# Altium schematic sheet [1]Esp32.SchDoc
size A4
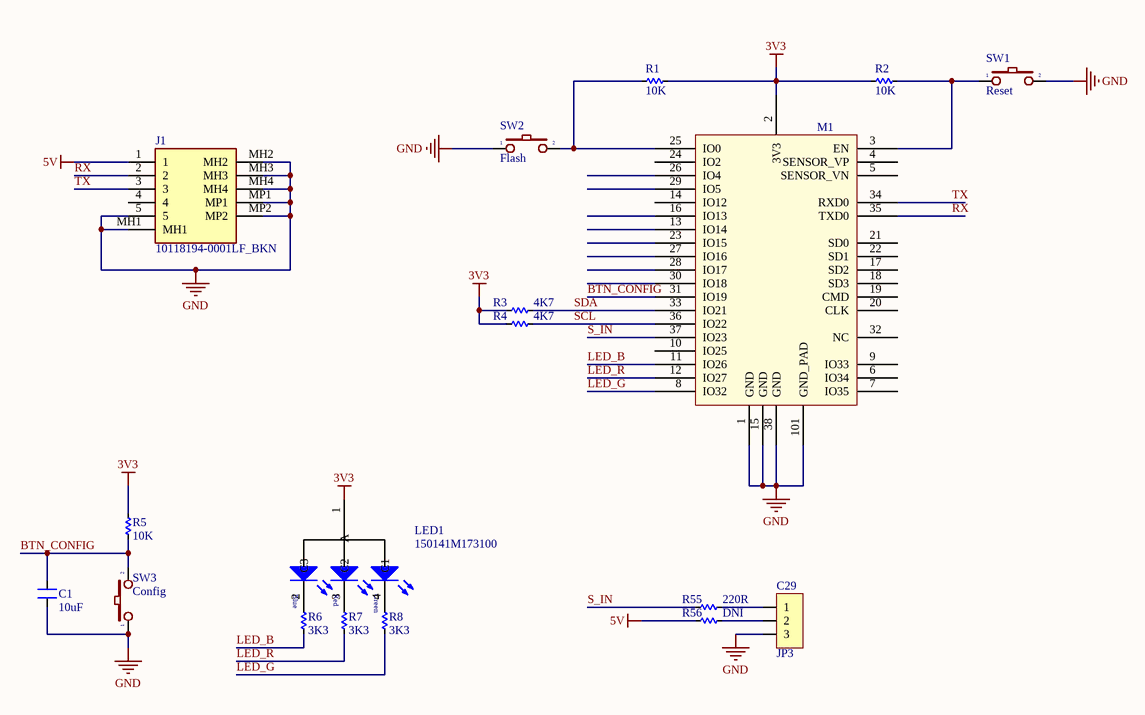
[diagram p0: [1]Esp32.SchDoc]

## Parts
C1  10uF  [CN-SMD-0603]
C29  JP3  [JP3-D1C]
J1  10118194-0001LF_BKN  [101181940001LFBKN]
LED1  150141M173100  [LED RGB 3528]
M1  ESP32S_Module  [ESP32S]  (value not drawn)
R1  10K  [RES-SMD-0603]
R2  10K  [RES-SMD-0603]
R3  4K7  [RES-SMD-0603]
R4  4K7  [RES-SMD-0603]
R5  10K  [RES-SMD-0603]
R6  3K3  [RES-SMD-0603]
R7  3K3  [RES-SMD-0603]
R8  3K3  [RES-SMD-0603]
R55  220R  [RES-SMD-0603]
R56  DNI  [RES-SMD-0603]
SW1  Reset  [SW1-SMD]
SW2  Flash  [SW-DIP1-1]
SW3  Config  [SW1-SMD]

## Nets
3V3: LED1.1(A) M1.2(3V3) R1.1 R2.2 R3.1 R4.1 R5.2
5V: J1.1 R56.2
GND: C1.2 C29.3 J1.5 J1.MH1 J1.MH2 J1.MH3 J1.MH4 J1.MP1 J1.MP2 M1.1(GND) M1.15(GND) M1.38(GND) M1.101(GND_PAD) SW1.2 SW2.1 SW3.1
BTN_CONFIG: C1.1 M1.31(IO19) R5.1 SW3.2
LED_B: M1.11(IO26) R6.1
LED_G: M1.8(IO32) R8.1
LED_R: M1.12(IO27) R7.1
RX: J1.2 M1.35(TXD0)
S_IN: M1.37(IO23) R55.2
SCL: M1.36(IO22) R4.2
SDA: M1.33(IO21) R3.2
TX: J1.3 M1.34(RXD0)
NetC29_1: C29.1 R55.1
NetC29_2: C29.2 R56.1
NetLED1_2: LED1.2(C3) R6.2
NetLED1_3: LED1.3(C2) R7.2
NetLED1_4: LED1.4(C1) R8.2
NetM1_3: M1.3(EN) R2.1 SW1.1
NetM1_25: M1.25(IO0) R1.2 SW2.2

Not connected (* = marked no-connect by the designer): J1 4; M1 4(SENSOR_VP) 5(SENSOR_VN) 6(IO34) 7(IO35) 9(IO33) 10(IO25) 13(IO14) 14(IO12) 16(IO13) 17(SD2) 18(SD3) 19(CMD) 20(CLK) 21(SD0) 22(SD1) 23(IO15) 24(IO2) 26(IO4) 27(IO16) 28(IO17) 29(IO5) 30(IO18) 32(NC)

## Notes on the sheet
- (in symbol LED RGB SMD) Blue; Red; Green

## Library data of the parts
C1 = CN: Tu gom; Value: 33pF
C29 = JP3: WR-PHD 2.54 mm Angled Socket Header; Manufacturer: W¨¹rth Elektronik eiSos GmbH; partNo: 613003143121; ComponentLink1 Description: Manufacturer; ComponentLink2 Description: Datasheet; NoPins: 03; Created Date: 29 March 2013; ComponentLink1URL: http://www.we-online.com; ComponentLink2URL: http://katalog.we-online.de/em/datasheet/6130xx143121.pdf; Created by: Karrer Zheng
J1 = 10118194-0001LF_BKN: Connector; Manufacturer_Name: Amphenol; Manufacturer_Part_Number: 10118194-0001LF/BKN; Datasheet Link: https://cdn.amphenol-cs.com/media/wysiwyg/files/drawing/10118194.pdf; Height: 2.78mm
LED1 = LED RGB SMD: SMD Full-Color Top LED, WL-SFTW, Red & Green & Blue; Manufacturer: Würth Elektronik eiSos GmbH; PartNo: 150141M173100; ComponentLink1Description: Manufacturer; ComponentLink1URL: http://www.we-online.de; Created by: Christin Otto; Created Date: June 2013; ComponentLink2Description: Datasheet; ComponentLink2URL: http://katalog.we-online.com/led/datasheet/150141M173100.pdf; Color: Red & Green & Blue
M1 = ESP32S_Module: Esp-32S; Datasheet: https://espressif.com/sites/default/files/documentation/esp_wroom_32_datasheet_en.pdf
R1-R8 R55 R56 = Res-SMD: Resistor; Manufacturer: Generic Components; Class: Passive; Published: 08/06/2000; Publisher: Altium Hobart Technology Centre
SW1-SW3 = SW2: Switch button 2 pin; Value: SW chip 2 pin